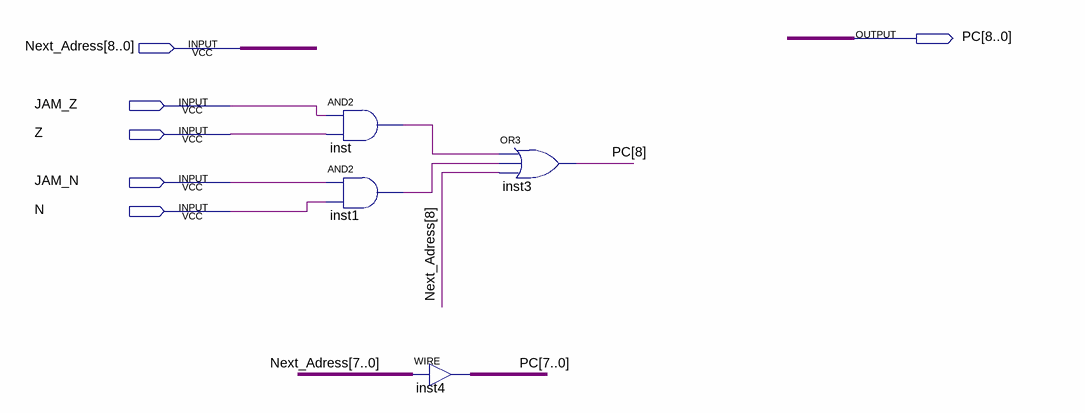
[diagram p0: schematic sheet]
// Quartus schematic control_unit.bdf as structural Verilog: 4 symbols, 6 pins
module control_unit (
  input  [8:0] Next_Adress,
  input  JAM_Z,
  input  Z,
  input  JAM_N,
  input  N,
  output [8:0] PC
);

  wire inst1_out, inst_out;

  and inst (inst_out, JAM_Z, Z);
  and inst1 (inst1_out, JAM_N, N);
  assign PC[7:0] = Next_Adress[7:0];  // WIRE inst4
  or inst3 (PC[8], inst_out, inst1_out, Next_Adress[8]);
endmodule
